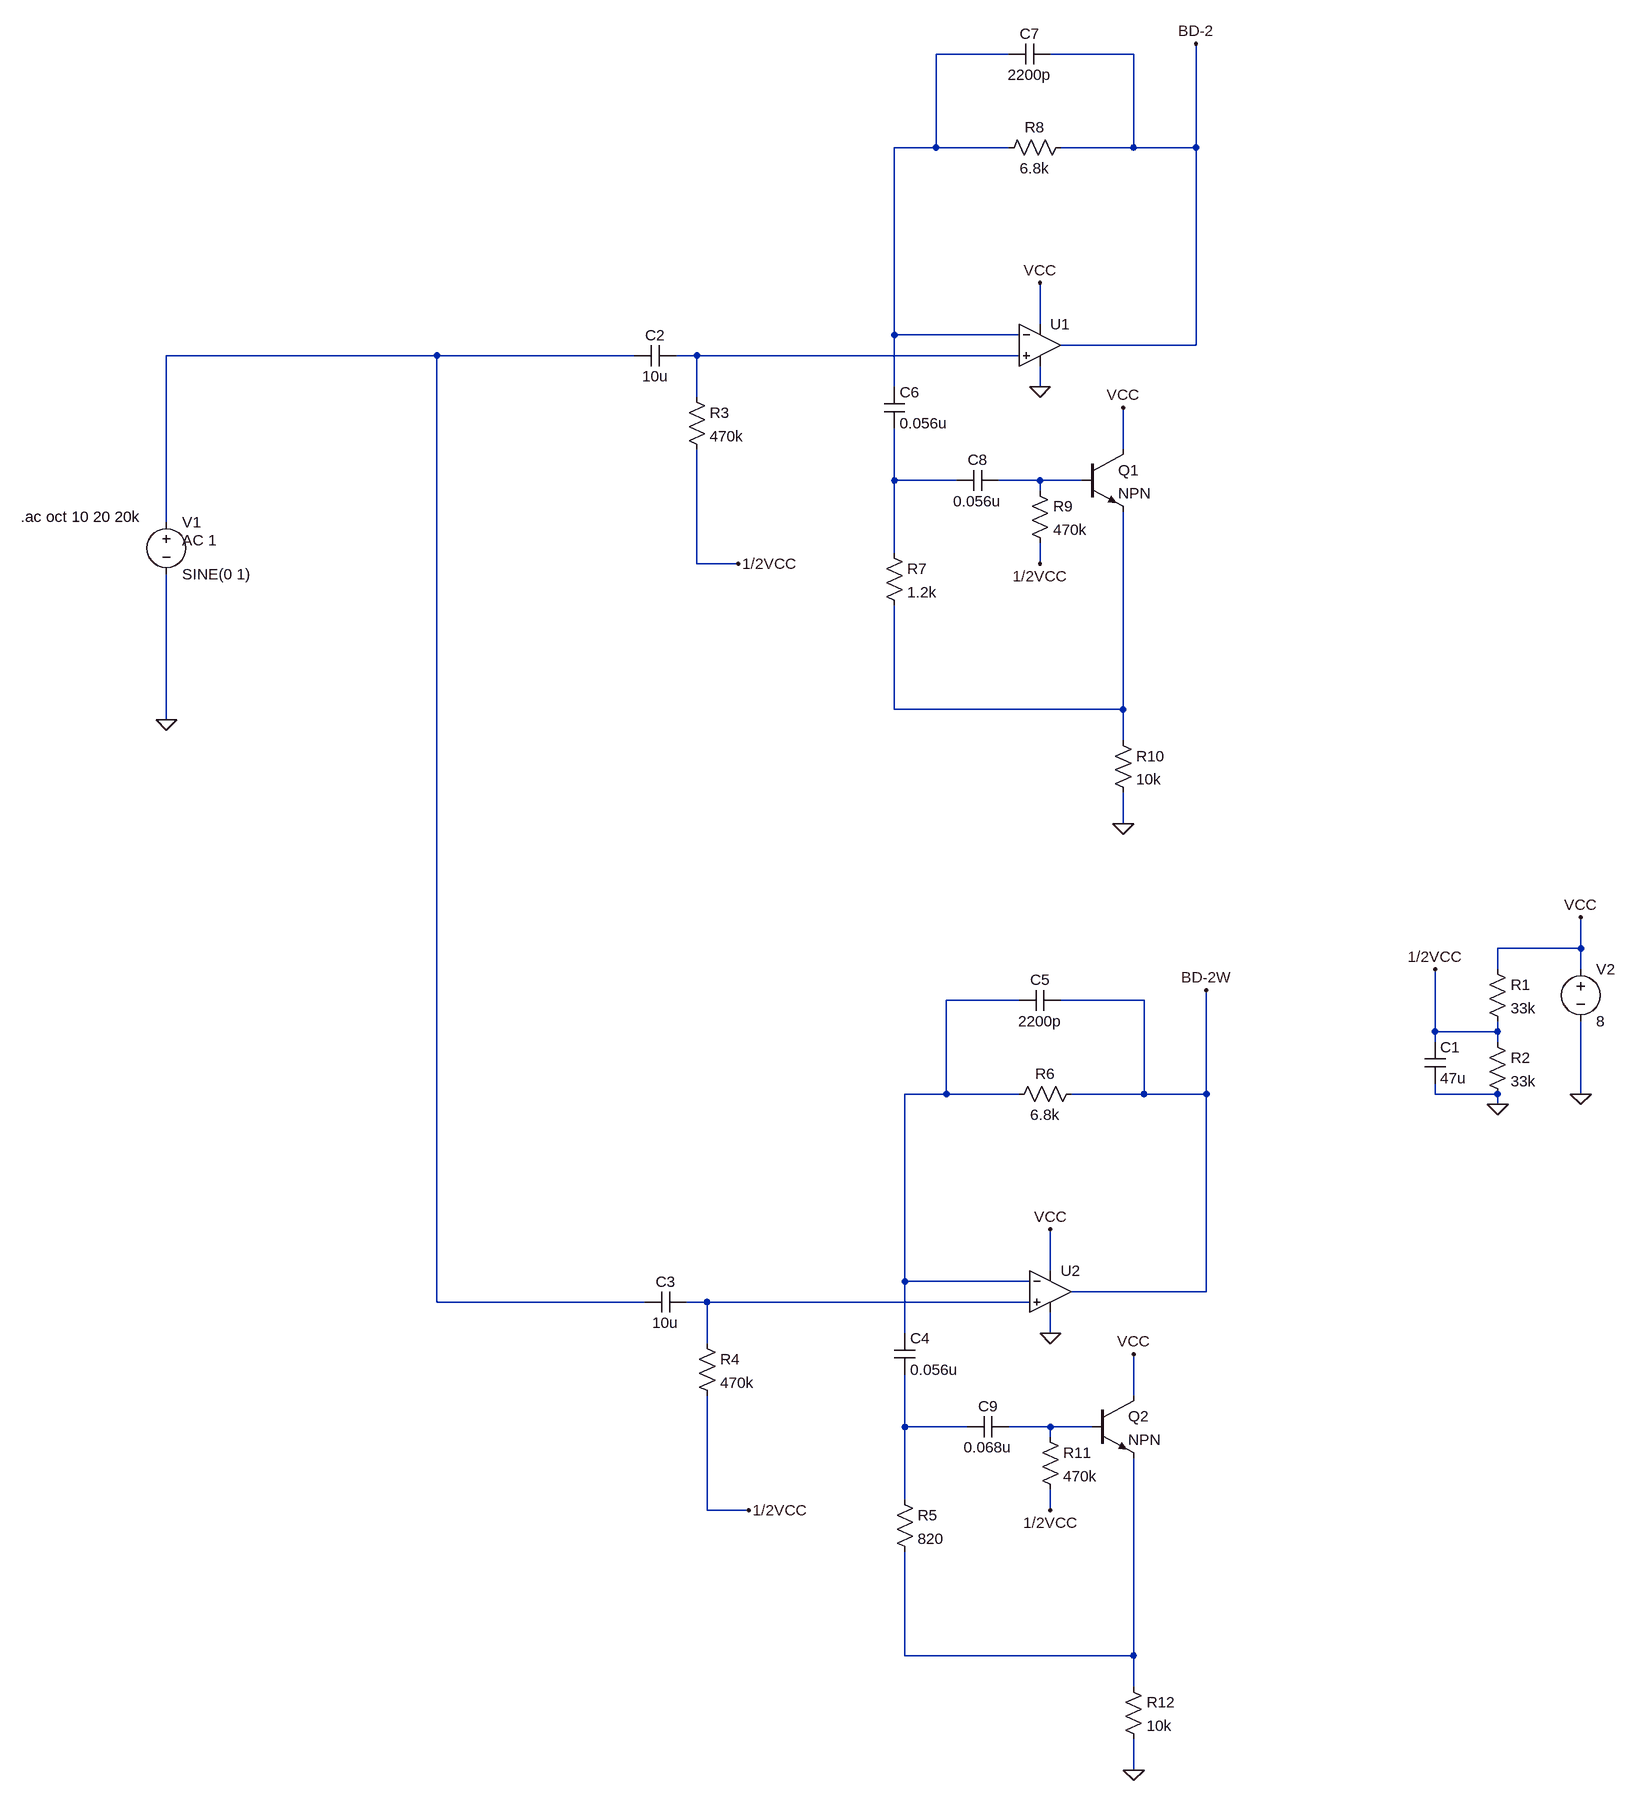
[diagram p0: schematic BD-2_BD-2W_LowPeak.asc]
BD-2_BD-2W_LowPeak.asc, the LTspice schematic file:
Version 4
SHEET 1 1644 1828
WIRE 704 -832 592 -832
WIRE 896 -832 768 -832
WIRE 592 -688 592 -832
WIRE 592 -688 528 -688
WIRE 704 -688 592 -688
WIRE 896 -688 896 -832
WIRE 896 -688 784 -688
WIRE 992 -688 992 -848
WIRE 992 -688 896 -688
WIRE 752 -416 752 -480
WIRE 528 -400 528 -688
WIRE 720 -400 528 -400
WIRE 992 -384 992 -688
WIRE 992 -384 784 -384
WIRE -176 -368 -592 -368
WIRE 128 -368 -176 -368
WIRE 224 -368 192 -368
WIRE 720 -368 224 -368
WIRE 528 -320 528 -400
WIRE 752 -320 752 -352
WIRE 224 -304 224 -368
WIRE 880 -224 880 -288
WIRE 528 -176 528 -256
WIRE 624 -176 528 -176
WIRE 752 -176 688 -176
WIRE 816 -176 752 -176
WIRE 752 -160 752 -176
WIRE -592 -112 -592 -368
WIRE 528 -64 528 -176
WIRE 224 -48 224 -224
WIRE 288 -48 224 -48
WIRE 752 -48 752 -80
WIRE 528 176 528 16
WIRE 880 176 880 -128
WIRE 880 176 528 176
WIRE -592 192 -592 -32
WIRE 880 224 880 176
WIRE 880 352 880 304
WIRE 1584 544 1584 496
WIRE 1584 544 1456 544
WIRE 1456 576 1456 544
WIRE 1584 576 1584 544
WIRE 720 624 608 624
WIRE 912 624 784 624
WIRE 1360 672 1360 576
WIRE 1456 672 1456 656
WIRE 1456 672 1360 672
WIRE 1360 688 1360 672
WIRE 1456 688 1456 672
WIRE 608 768 608 624
WIRE 608 768 544 768
WIRE 720 768 608 768
WIRE 912 768 912 624
WIRE 912 768 800 768
WIRE 1008 768 1008 608
WIRE 1008 768 912 768
WIRE 1360 768 1360 752
WIRE 1456 768 1360 768
WIRE 1584 768 1584 656
WIRE 1456 784 1456 768
WIRE 768 1040 768 976
WIRE 544 1056 544 768
WIRE 736 1056 544 1056
WIRE 1008 1072 1008 768
WIRE 1008 1072 800 1072
WIRE -176 1088 -176 -368
WIRE 144 1088 -176 1088
WIRE 240 1088 208 1088
WIRE 736 1088 240 1088
WIRE 544 1136 544 1056
WIRE 768 1136 768 1104
WIRE 240 1152 240 1088
WIRE 896 1232 896 1168
WIRE 544 1280 544 1200
WIRE 640 1280 544 1280
WIRE 768 1280 704 1280
WIRE 832 1280 768 1280
WIRE 768 1296 768 1280
WIRE 544 1392 544 1280
WIRE 240 1408 240 1232
WIRE 304 1408 240 1408
WIRE 768 1408 768 1376
WIRE 544 1632 544 1472
WIRE 896 1632 896 1328
WIRE 896 1632 544 1632
WIRE 896 1680 896 1632
WIRE 896 1808 896 1760
FLAG -592 192 0
FLAG 1584 768 0
FLAG 1584 496 VCC
FLAG 1456 784 0
FLAG 1360 576 1/2VCC
FLAG 752 -320 0
FLAG 752 -480 VCC
FLAG 288 -48 1/2VCC
FLAG 992 -848 BD-2
FLAG 752 -48 1/2VCC
FLAG 880 -288 VCC
FLAG 880 352 0
FLAG 768 1136 0
FLAG 768 976 VCC
FLAG 304 1408 1/2VCC
FLAG 1008 608 BD-2W
FLAG 768 1408 1/2VCC
FLAG 896 1168 VCC
FLAG 896 1808 0
SYMBOL voltage -592 -128 R0
WINDOW 123 24 44 Left 2
WINDOW 39 0 0 Left 2
SYMATTR Value2 AC 1
SYMATTR InstName V1
SYMATTR Value SINE(0 1)
SYMBOL voltage 1584 560 R0
WINDOW 123 0 0 Left 2
WINDOW 39 0 0 Left 2
SYMATTR InstName V2
SYMATTR Value 8
SYMBOL res 1440 560 R0
SYMATTR InstName R1
SYMATTR Value 33k
SYMBOL res 1440 672 R0
SYMATTR InstName R2
SYMATTR Value 33k
SYMBOL cap 1344 688 R0
SYMATTR InstName C1
SYMATTR Value 47u
SYMBOL Opamps\\UniversalOpamp2 752 -384 R0
SYMATTR InstName U1
SYMBOL res 208 -320 R0
SYMATTR InstName R3
SYMATTR Value 470k
SYMBOL cap 192 -384 R90
WINDOW 0 0 32 VBottom 2
WINDOW 3 32 32 VTop 2
SYMATTR InstName C2
SYMATTR Value 10u
SYMBOL res 512 -80 R0
SYMATTR InstName R7
SYMATTR Value 1.2k
SYMBOL cap 512 -320 R0
SYMATTR InstName C6
SYMATTR Value 0.056u
SYMBOL cap 768 -848 R90
WINDOW 0 0 32 VBottom 2
WINDOW 3 32 32 VTop 2
SYMATTR InstName C7
SYMATTR Value 2200p
SYMBOL res 800 -704 R90
WINDOW 0 0 56 VBottom 2
WINDOW 3 32 56 VTop 2
SYMATTR InstName R8
SYMATTR Value 6.8k
SYMBOL res 736 -176 R0
SYMATTR InstName R9
SYMATTR Value 470k
SYMBOL npn 816 -224 R0
SYMATTR InstName Q1
SYMBOL cap 688 -192 R90
WINDOW 0 0 32 VBottom 2
WINDOW 3 32 32 VTop 2
SYMATTR InstName C8
SYMATTR Value 0.056u
SYMBOL res 864 208 R0
SYMATTR InstName R10
SYMATTR Value 10k
SYMBOL Opamps\\UniversalOpamp2 768 1072 R0
SYMATTR InstName U2
SYMBOL res 224 1136 R0
SYMATTR InstName R4
SYMATTR Value 470k
SYMBOL cap 208 1072 R90
WINDOW 0 0 32 VBottom 2
WINDOW 3 32 32 VTop 2
SYMATTR InstName C3
SYMATTR Value 10u
SYMBOL res 528 1376 R0
SYMATTR InstName R5
SYMATTR Value 820
SYMBOL cap 528 1136 R0
SYMATTR InstName C4
SYMATTR Value 0.056u
SYMBOL cap 784 608 R90
WINDOW 0 0 32 VBottom 2
WINDOW 3 32 32 VTop 2
SYMATTR InstName C5
SYMATTR Value 2200p
SYMBOL res 816 752 R90
WINDOW 0 0 56 VBottom 2
WINDOW 3 32 56 VTop 2
SYMATTR InstName R6
SYMATTR Value 6.8k
SYMBOL res 752 1280 R0
SYMATTR InstName R11
SYMATTR Value 470k
SYMBOL npn 832 1232 R0
SYMATTR InstName Q2
SYMBOL cap 704 1264 R90
WINDOW 0 0 32 VBottom 2
WINDOW 3 32 32 VTop 2
SYMATTR InstName C9
SYMATTR Value 0.068u
SYMBOL res 880 1664 R0
SYMATTR InstName R12
SYMATTR Value 10k
TEXT -816 -120 Left 2 !.ac oct 10 20 20k

The netlist it stands for:
* BD-2_BD-2W_LowPeak.asc
V1 N002 0 SINE(0 1) AC 1
V2 VCC 0 8
R1 VCC 1/2VCC 33k
R2 1/2VCC 0 33k
C1 1/2VCC 0 47u
XU1 N003 N001 VCC 0 BD-2 level.2 Avol=1Meg GBW=10Meg Slew=10Meg ilimit=25m rail=0 Vos=0 phimargin=45 en=0 enk=0 in=0 ink=0 Rin=500Meg  ; pins IN+ IN- V+ V- OUT
R3 N003 1/2VCC 470k
C2 N003 N002 10u
R7 N004 N006 1.2k
C6 N001 N004 0.056u
C7 BD-2 N001 2200p
R8 BD-2 N001 6.8k
R9 N005 1/2VCC 470k
Q1 VCC N005 N006 0 NPN
C8 N005 N004 0.056u
R10 N006 0 10k
XU2 N008 N007 VCC 0 BD-2W level.2 Avol=1Meg GBW=10Meg Slew=10Meg ilimit=25m rail=0 Vos=0 phimargin=45 en=0 enk=0 in=0 ink=0 Rin=500Meg  ; pins IN+ IN- V+ V- OUT
R4 N008 1/2VCC 470k
C3 N008 N002 10u
R5 N009 N011 820
C4 N007 N009 0.056u
C5 BD-2W N007 2200p
R6 BD-2W N007 6.8k
R11 N010 1/2VCC 470k
Q2 VCC N010 N011 0 NPN
C9 N010 N009 0.068u
R12 N011 0 10k
.model NPN NPN
.model PNP PNP
.lib standard.bjt
.ac oct 10 20 20k
.lib UniversalOpamps2.sub
.backanno
.end